# Altium schematic sheet Crystal_32MHz.SchDoc: Crystal 32MHz
size A4
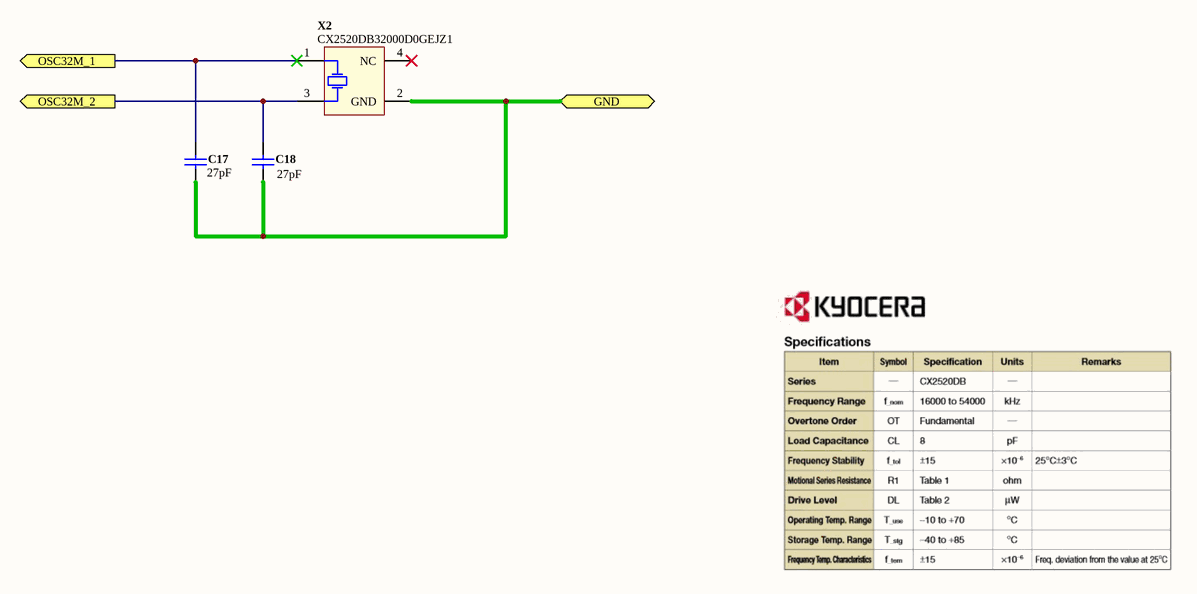
[diagram p0: Crystal_32MHz.SchDoc]

## Parts
C17  value 27pF  [CAPC0402(1005)60_L]  (hidden comment: CAP 27pF 16V 0402(1005))
C18  value 27pF  [CAPC0402(1005)60_L]  (hidden comment: CAP 27pF 16V 0402(1005))
X2  CX2520DB32000D0GEJZ1  [AVX-CX2520DB32000D0GEJZ1-4_V]

## Ports
GND, OSC32M_1 (out), OSC32M_2 (out)

## Nets
GND: C17.1 C18.1 X2.2(GND) ; port GND
OSC32M_1: C17.2 X2.1(HOT) ; port OSC32M_1
OSC32M_2: C18.2 X2.3(HOT) ; port OSC32M_2

Not connected (* = marked no-connect by the designer): X2 4(NC)*

## Notes on the sheet
- Sheet Title
- Project Title
- Size:
- Date:
- A4
- Item:
- Time:
- Revision:
- Sheet
- of
- File:

## Library data of the parts
C17 C18 = CMP-1034-00950-1: CAP 27pF 16V ±1% 0402 (1005 Metric) Thickness 0.6mm SMD; Case-EIA: 0402; Case-Metric: 1005; Technology: SMT; Max Thickness: 0.6 mm; Rated Voltage: 16 V; Tolerance: ±1%
X2 = CMP-0449-00001-1: Crystal, 32 MHz, 8 pF, -10 to 70 degC, Surface Mount 2.5 x 2.0 mm; Manufacturer: Kyocera; Drive Level: 10uW (100uW max.); Motional Series Resistance: 50 ohm (max); Frequency Range: 32000 kHz; Load Capacitance: 8 pF; Packing: Tape and Reel; ComponentLink2URL: http://global.kyocera.com/prdct/electro/pdf/xtal/cx2520db_cs_e.pdf; ComponentLink1Description: Manufacturer URL; PackageDescription: 4-Pin Hand Drawn，Body 2.5x2mm; ComponentLink1URL: http://global.kyocera.com/; ComponentLink3URL: http://global.kyocera.com/prdct/electro/pdf/xtal/cx2520db_cs_e.pdf; ComponentLink2Description: Datasheet; PackageReference: CX2520DB32000D0GEJZ1-4; Operating Temperature: -10 to 70 degC; PartNumber: CX2520DB32000D0GEJZ1; ComponentLink3Description: Package Specification; Mounting Technology: Surface Mount